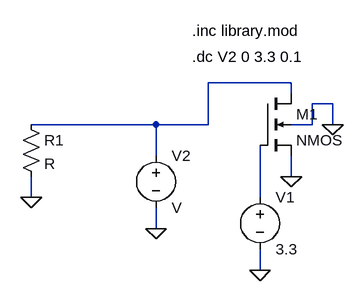
[diagram p0: schematic Draft1.asc]
Draft1.asc, the LTspice schematic file:
Version 4
SHEET 1 880 680
WIRE 464 32 336 32
WIRE 464 48 464 32
WIRE 528 64 496 64
WIRE 256 96 64 96
WIRE 336 96 336 32
WIRE 336 96 256 96
WIRE 496 96 496 64
WIRE 496 96 464 96
WIRE 528 96 528 64
WIRE 256 144 256 96
WIRE 464 176 464 144
WIRE 64 208 64 176
WIRE 416 208 416 128
WIRE 256 256 256 224
WIRE 416 320 416 288
FLAG 64 208 0
FLAG 256 256 0
FLAG 416 320 0
FLAG 464 176 0
FLAG 528 96 0
SYMBOL res 48 80 R0
SYMATTR InstName R1
SYMBOL voltage 416 192 R0
WINDOW 123 0 0 Left 0
WINDOW 39 0 0 Left 0
SYMATTR InstName V1
SYMATTR Value 3.3
SYMBOL voltage 256 128 R0
SYMATTR InstName V2
SYMBOL nmos4 416 48 R0
SYMATTR InstName M1
TEXT 312 -48 Left 2 !.inc library.mod
TEXT 312 -8 Left 2 !.dc V2 0 3.3 0.1

The netlist it stands for:
* Draft1.asc
R1 N001 0 R
V1 N002 0 3.3
V2 N001 0 V
M1 N001 N002 0 0 NMOS
.model NMOS NMOS
.model PMOS PMOS
.lib standard.mos
.inc library.mod
.dc V2 0 3.3 0.1
.backanno
.end